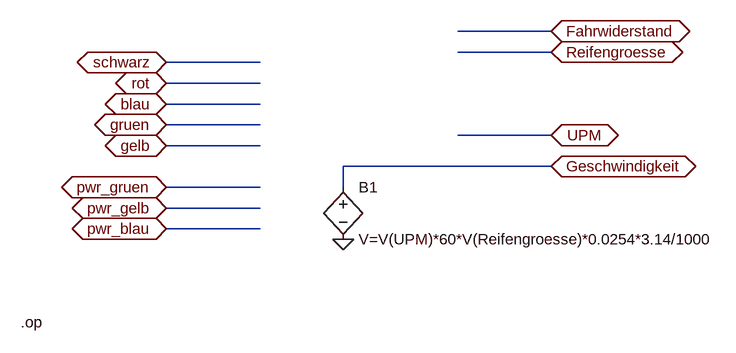
[diagram p0: schematic Hinterradnabenmotor.asc]
Hinterradnabenmotor.asc, the LTspice schematic file:
Version 4
SHEET 1 1248 836
WIRE 608 32 464 32
WIRE 608 64 464 64
WIRE 160 80 16 80
WIRE 160 112 16 112
WIRE 160 144 16 144
WIRE 160 176 16 176
WIRE 608 192 464 192
WIRE 160 208 16 208
WIRE 608 240 288 240
WIRE 160 272 16 272
WIRE 288 272 288 240
WIRE 160 304 16 304
WIRE 160 336 16 336
FLAG 16 80 schwarz
IOPIN 16 80 BiDir
FLAG 16 112 rot
IOPIN 16 112 BiDir
FLAG 16 144 blau
IOPIN 16 144 BiDir
FLAG 16 176 gruen
IOPIN 16 176 BiDir
FLAG 16 208 gelb
IOPIN 16 208 BiDir
FLAG 16 272 pwr_gruen
IOPIN 16 272 BiDir
FLAG 16 304 pwr_gelb
IOPIN 16 304 BiDir
FLAG 16 336 pwr_blau
IOPIN 16 336 BiDir
FLAG 608 32 Fahrwiderstand
IOPIN 608 32 BiDir
FLAG 608 192 UPM
IOPIN 608 192 BiDir
FLAG 608 240 Geschwindigkeit
IOPIN 608 240 BiDir
FLAG 288 352 0
FLAG 608 64 Reifengroesse
IOPIN 608 64 BiDir
SYMBOL bv 288 256 R0
SYMATTR InstName B1
SYMATTR Value V=V(UPM)*60*V(Reifengroesse)*0.0254*3.14/1000
TEXT -208 480 Left 2 !.op

The netlist it stands for:
* Hinterradnabenmotor.asc
B1 Geschwindigkeit 0 V=V(UPM)*60*V(Reifengroesse)*0.0254*3.14/1000
.op
.backanno
.end